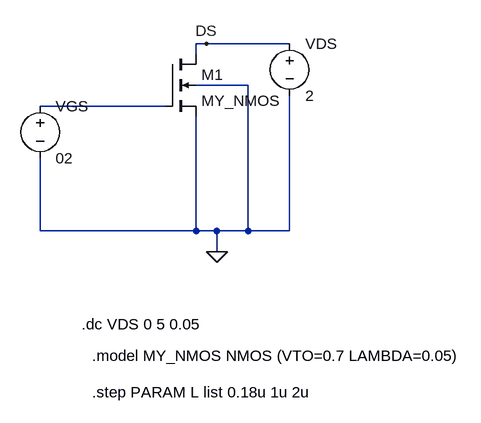
[diagram p0: schematic Channel_length_modulation.asc]
Channel_length_modulation.asc, the LTspice schematic file:
Version 4.1
SHEET 1 880 680
WIRE 144 -80 128 -80
WIRE 272 -80 144 -80
WIRE 128 -64 128 -80
WIRE 208 -16 128 -16
WIRE 80 16 -112 16
WIRE -112 208 -112 96
WIRE 128 208 128 32
WIRE 128 208 -112 208
WIRE 160 208 128 208
WIRE 208 208 208 -16
WIRE 208 208 160 208
WIRE 272 208 272 0
WIRE 272 208 208 208
WIRE 160 240 160 208
FLAG 144 -80 DS
FLAG 160 240 0
SYMBOL voltage -112 0 R0
WINDOW 123 0 0 Left 0
WINDOW 39 0 0 Left 0
SYMATTR InstName VGS
SYMATTR Value 02
SYMBOL voltage 272 -96 R0
WINDOW 123 0 0 Left 0
WINDOW 39 0 0 Left 0
SYMATTR InstName VDS
SYMATTR Value 2
SYMBOL nmos4 80 -64 R0
SYMATTR InstName M1
SYMATTR Value MY_NMOS
SYMATTR Value2 l={L} w=10u
TEXT -48 352 Left 2 !.dc VDS 0 5 0.05
TEXT -32 400 Left 2 !.model MY_NMOS NMOS (VTO=0.7 LAMBDA=0.05)
TEXT -32 456 Left 2 !.step PARAM L list 0.18u 1u 2u

The netlist it stands for:
* Channel_length_modulation.asc
VGS N001 0 02
VDS DS 0 2
M1 DS N001 0 0 MY_NMOS l={L} w=10u
.model NMOS NMOS
.model PMOS PMOS
.lib standard.mos
.dc VDS 0 5 0.05
.model MY_NMOS NMOS (VTO=0.7 LAMBDA=0.05)
.step PARAM L list 0.18u 1u 2u
.backanno
.end